# EAGLE schematic Smarttree_CMU_6 (EAGLE 7.7.0)

## Sheet 1 of 2
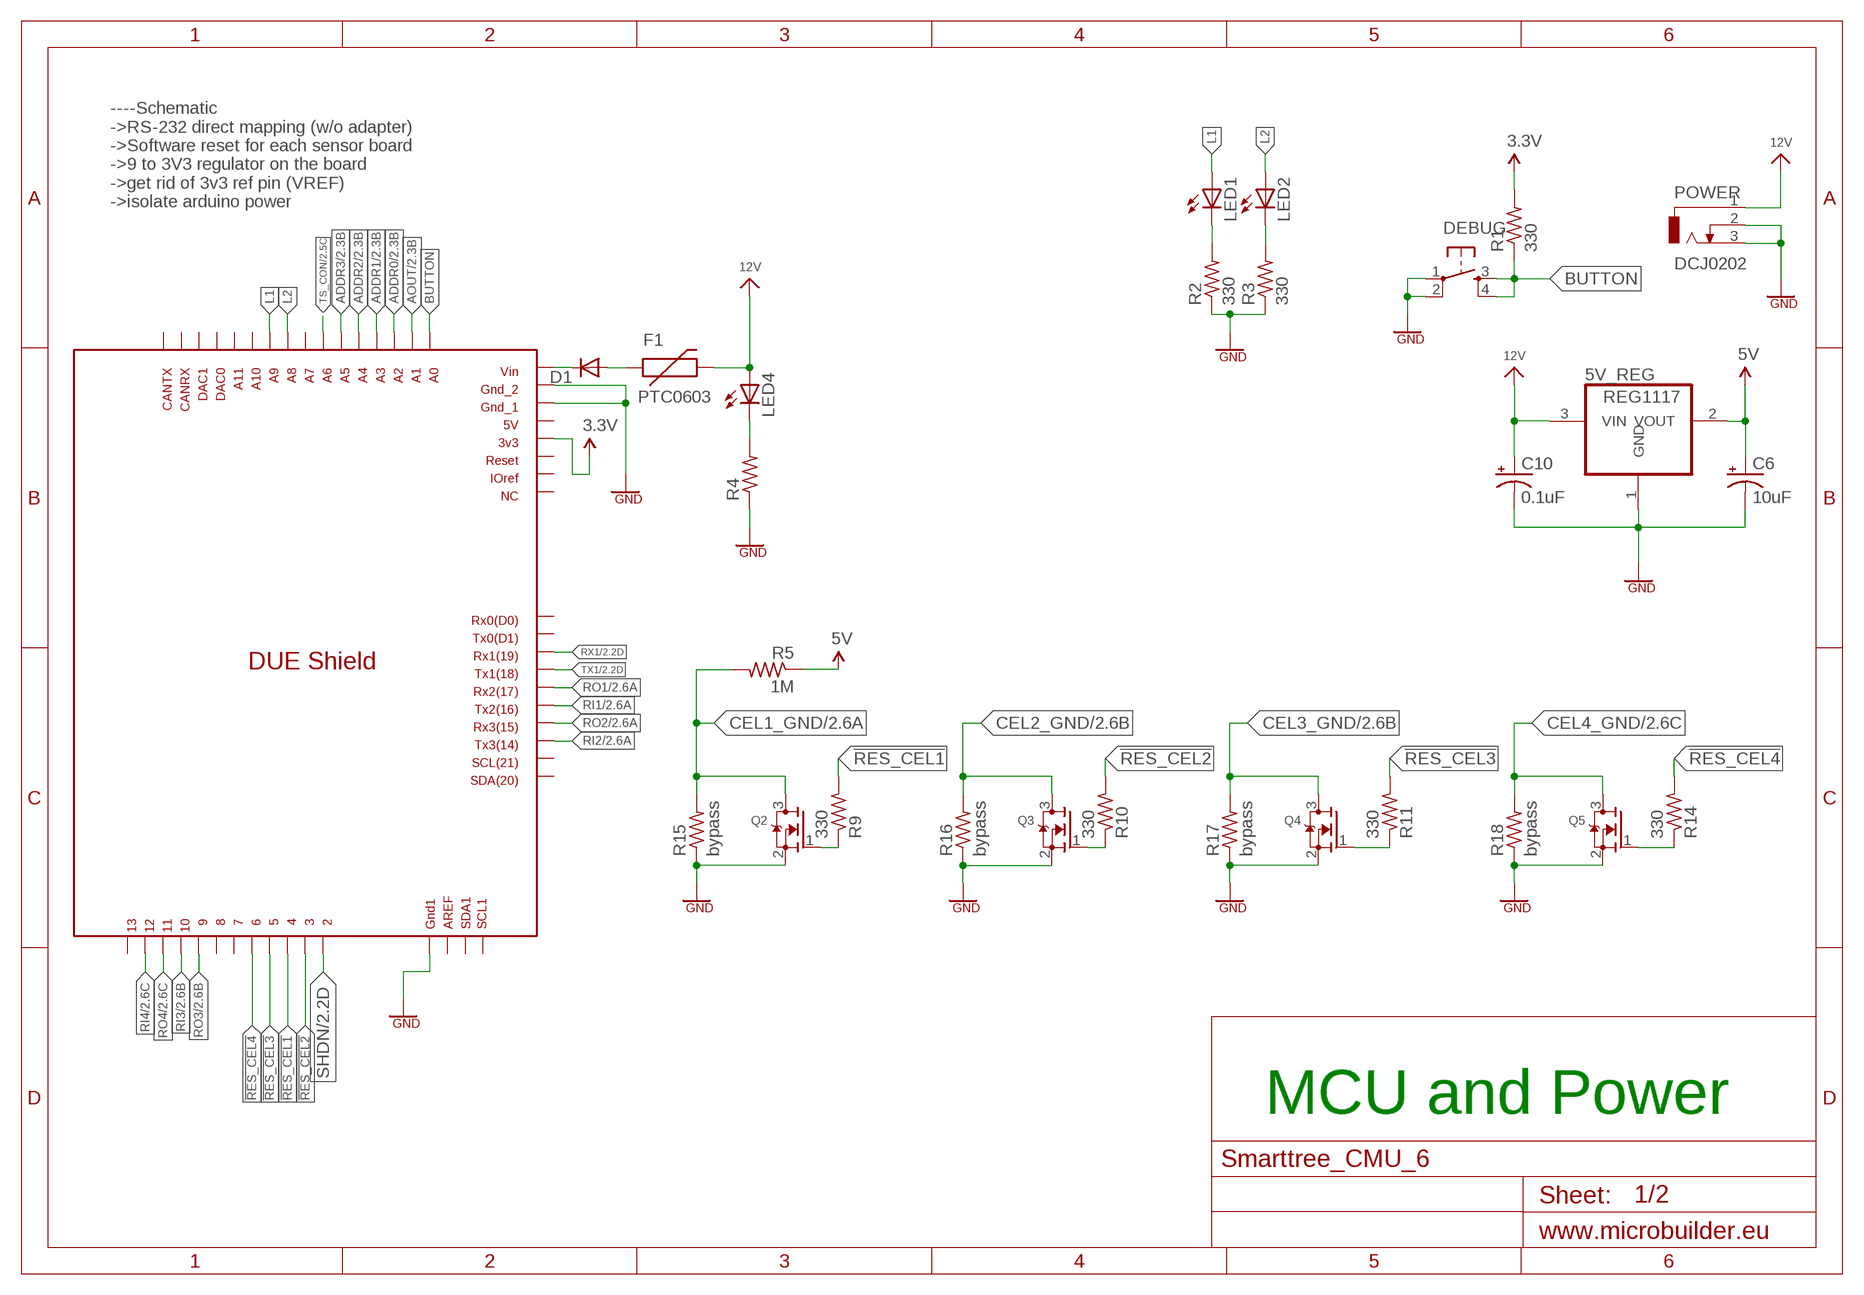
[diagram p0: schematic, sheet 1]

### Parts
5V_REG  REG1117  [SOT223]
C6  10uF  10UF-TANT  [EIA3216]
C10  0.1uF  10UF-TANT  [EIA3216]
D1  DIODE-SOD106-R  [SOD106-R]
DEBUG  TAC_SWITCHSMD  [TACTILE_SWITCH_SMD]
F1  PTC0603  [0603]
LED1  LED-YELLOW0603  [LED-0603]
LED2  LED-YELLOW0603  [LED-0603]
LED4  LED-YELLOW0603  [LED-0603]
POWER  DCJ0202  [DCJ0202]
Q2  MOSFET-NREFLOW  [SOT23]
Q3  MOSFET-NREFLOW  [SOT23]
Q4  MOSFET-NREFLOW  [SOT23]
Q5  MOSFET-NREFLOW  [SOT23]
R1  330  R-US_M0805  [M0805]
R2  330  R-US_M0805  [M0805]
R3  330  R-US_M0805  [M0805]
R4  R-US_M0805  [M0805]
R5  1M  R-US_R0805  [R0805]
R9  330  R-US_R0805  [R0805]
R10  330  R-US_R0805  [R0805]
R11  330  R-US_R0805  [R0805]
R14  330  R-US_R0805  [R0805]
R15  bypass  R-US_M0805  [M0805]
R16  bypass  R-US_M0805  [M0805]
R17  bypass  R-US_M0805  [M0805]
R18  bypass  R-US_M0805  [M0805]
U$1  DUE(OUTLINE)  [DUE(NORMAL)]

### Nets
3.3V: R1.2 U$1.3V3 ; also sheet 2
5V: 5V_REG.2(VOUT) C6.A(+) R5.1 ; also sheet 2
12V: 5V_REG.3(VIN) C10.A(+) F1.2 LED4.A POWER.1 ; also sheet 2
!RES_CEL1: R9.2 U$1.4
!RES_CEL2: R10.2 U$1.3
!RES_CEL3: R11.2 U$1.5
!RES_CEL4: R14.2 U$1.6
ADDR0: U$1.A2 ; also sheet 2
ADDR1: U$1.A3 ; also sheet 2
ADDR2: U$1.A4 ; also sheet 2
ADDR3: U$1.A5 ; also sheet 2
AOUT: U$1.A1 ; also sheet 2
BUTTON: DEBUG.3 DEBUG.4 R1.1 U$1.A0
CEL1_GND: Q2.3(D) R5.2 R15.2 ; also sheet 2
CEL2_GND: Q3.3(D) R16.2 ; also sheet 2
CEL3_GND: Q4.3(D) R17.2 ; also sheet 2
CEL4_GND: Q5.3(D) R18.2 ; also sheet 2
GND: 5V_REG.1(GND) C6.C(-) C10.C(-) DEBUG.1 DEBUG.2 POWER.2 POWER.3 Q2.2(S) Q3.2(S) Q4.2(S) Q5.2(S) R2.1 R3.1 R4.1 R15.1 R16.1 R17.1 R18.1 U$1.GND1 U$1.GND_1 U$1.GND_2 ; also sheet 2
L1: LED1.A U$1.A9
L2: LED2.A U$1.A8
N$3: Q3.1(G) R10.1
N$6: Q2.1(G) R9.1
N$7: Q4.1(G) R11.1
N$9: Q5.1(G) R14.1
N$13: D1.C U$1.VIN
N$57: LED1.C R2.2
N$58: LED2.C R3.2
N$59: LED4.C R4.2
N$69: D1.A F1.1
RI1: U$1.TX2 ; also sheet 2
RI2: U$1.TX3 ; also sheet 2
RI3: U$1.10 ; also sheet 2
RI4: U$1.12 ; also sheet 2
RO1: U$1.RX2 ; also sheet 2
RO2: U$1.RX3 ; also sheet 2
RO3: U$1.9 ; also sheet 2
RO4: U$1.11 ; also sheet 2
RX1: U$1.RX1 ; also sheet 2
SHDN: U$1.2 ; also sheet 2
TS_CON: U$1.A6 ; also sheet 2
TX1: U$1.TX1 ; also sheet 2
Unconnected: U$1.5V U$1.7 U$1.8 U$1.13 U$1.A7 U$1.A10 U$1.A11 U$1.AREF U$1.CANRX U$1.CANTX U$1.DAC0 U$1.DAC1 U$1.IOREF U$1.NC U$1.RESET U$1.RX0 U$1.SCL U$1.SCL1 U$1.SDA U$1.SDA1 U$1.TX0

### Notes on the sheet
- ----Schematic
  ->RS-232 direct mapping (w/o adapter)
  ->Software reset for each sensor board
  ->9 to 3V3 regulator on the board
  ->get rid of 3v3 ref pin (VREF)
  ->isolate arduino power
- MCU and Power

## Sheet 2 of 2
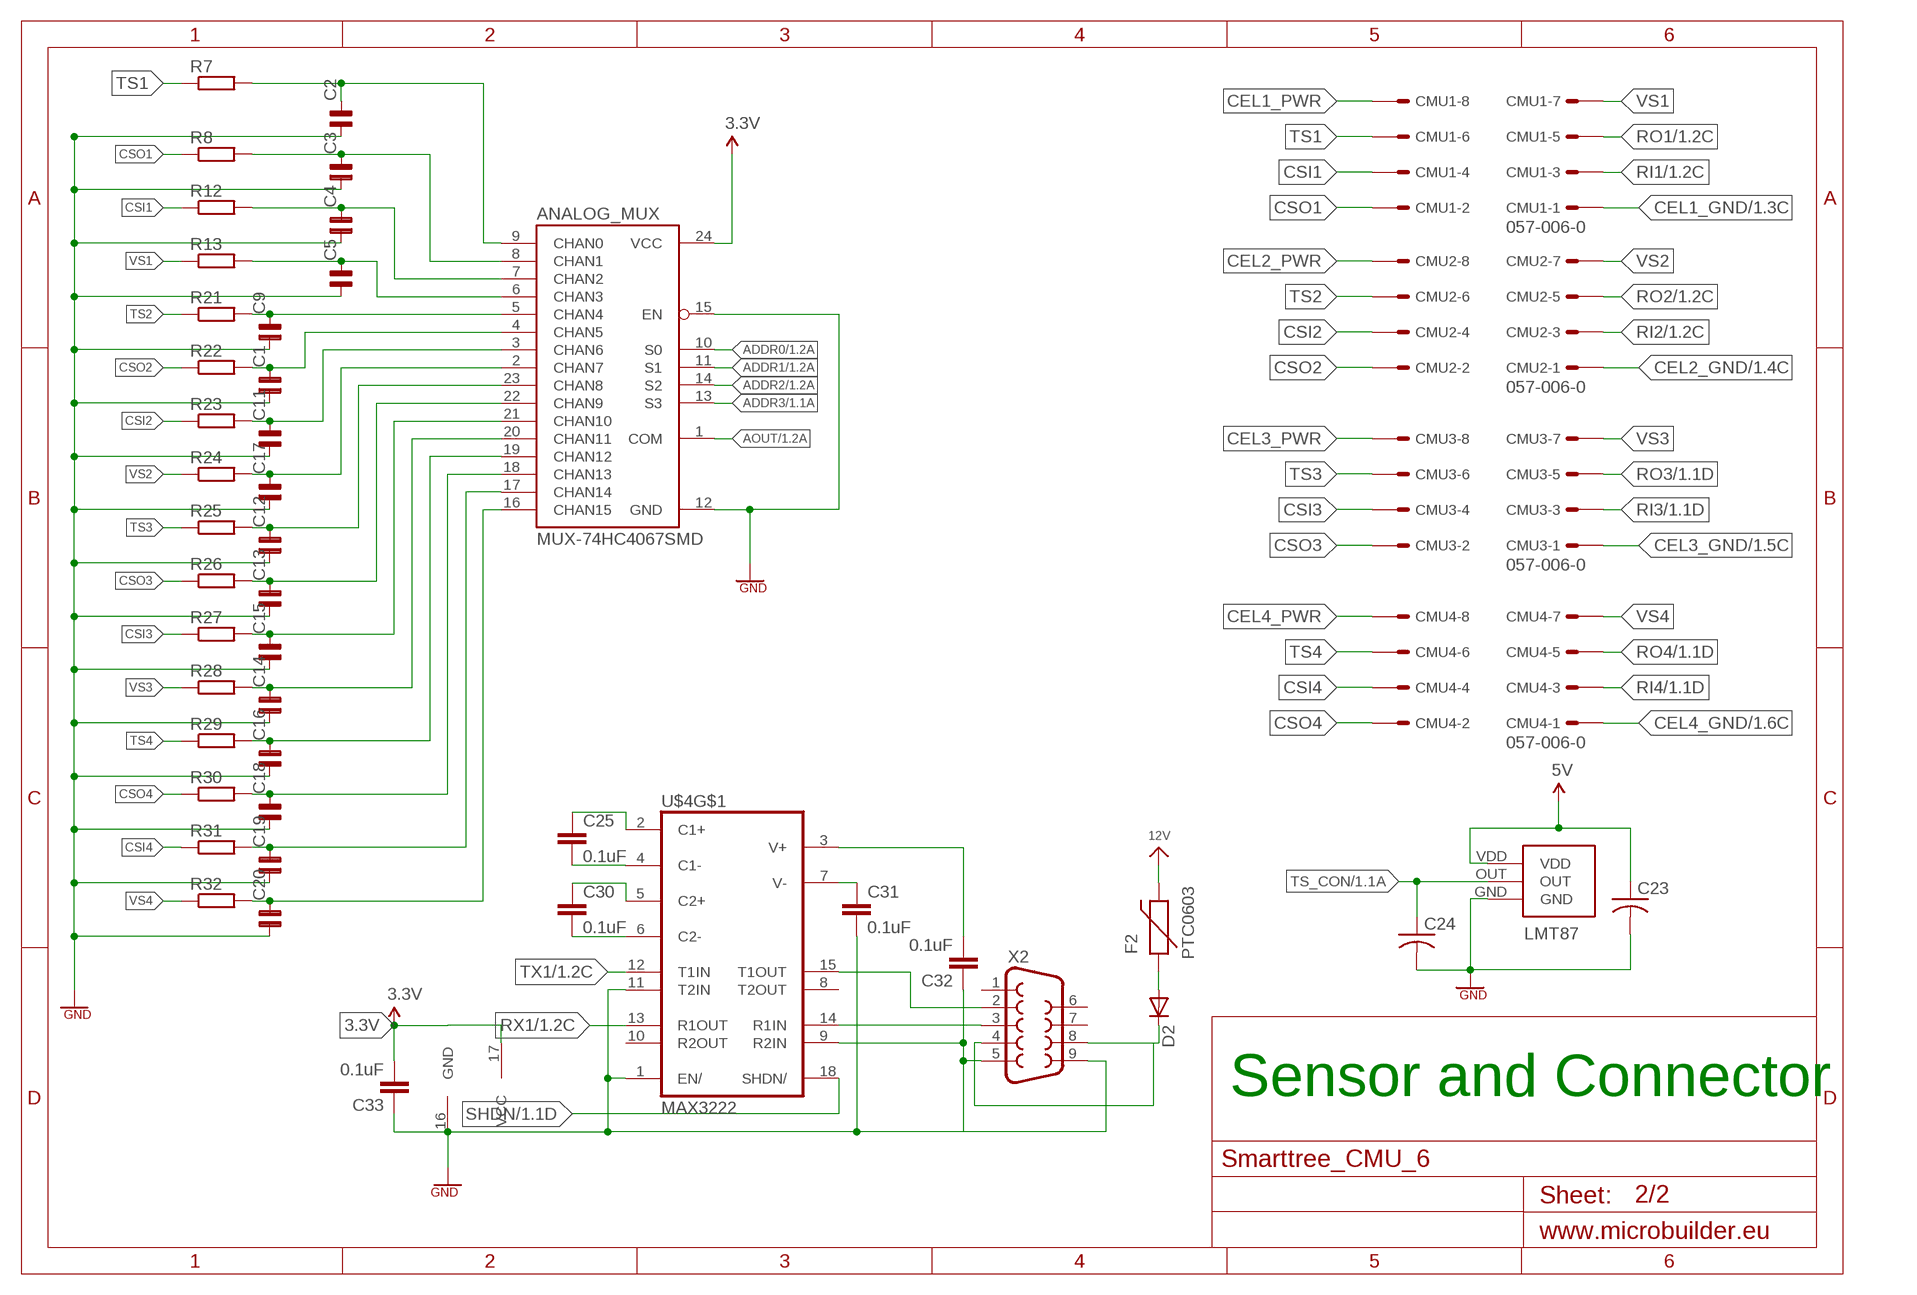
[diagram p1: schematic, sheet 2]

### Parts
ANALOG_MUX  MUX-74HC4067SMD  [SSOP24]
C1  C-NP-SMD-0805  [C-0805]
C2  C-NP-SMD-0805  [C-0805]
C3  C-NP-SMD-0805  [C-0805]
C4  C-NP-SMD-0805  [C-0805]
C5  C-NP-SMD-0805  [C-0805]
C9  C-NP-SMD-0805  [C-0805]
C11  C-NP-SMD-0805  [C-0805]
C12  C-NP-SMD-0805  [C-0805]
C13  C-NP-SMD-0805  [C-0805]
C14  C-NP-SMD-0805  [C-0805]
C15  C-NP-SMD-0805  [C-0805]
C16  C-NP-SMD-0805  [C-0805]
C17  C-NP-SMD-0805  [C-0805]
C18  C-NP-SMD-0805  [C-0805]
C19  C-NP-SMD-0805  [C-0805]
C20  C-NP-SMD-0805  [C-0805]
C23  C-USC0805  [C0805]
C24  C-USC0805  [C0805]
C25  0.1uF  CAP0603-CAP  [0603-CAP]
C30  0.1uF  CAP0603-CAP  [0603-CAP]
C31  0.1uF  CAP0603-CAP  [0603-CAP]
C32  0.1uF  CAP0603-CAP  [0603-CAP]
C33  0.1uF  CAP0603-CAP  [0603-CAP]
CMU1  057-006-0  [057-006-0]
CMU2  057-006-0  [057-006-0]
CMU3  057-006-0  [057-006-0]
CMU4  057-006-0  [057-006-0]
D2  DIODE-SOD106-R  [SOD106-R]
F2  PTC0603  [0603]
LMT87  LMT87_PAC  [LMT87_TO]
R7  R-EU_R0805W  [R0805W]
R8  R-EU_R0805W  [R0805W]
R12  R-EU_R0805W  [R0805W]
R13  R-EU_R0805W  [R0805W]
R21  R-EU_R0805W  [R0805W]
R22  R-EU_R0805W  [R0805W]
R23  R-EU_R0805W  [R0805W]
R24  R-EU_R0805W  [R0805W]
R25  R-EU_R0805W  [R0805W]
R26  R-EU_R0805W  [R0805W]
R27  R-EU_R0805W  [R0805W]
R28  R-EU_R0805W  [R0805W]
R29  R-EU_R0805W  [R0805W]
R30  R-EU_R0805W  [R0805W]
R31  R-EU_R0805W  [R0805W]
R32  R-EU_R0805W  [R0805W]
U$4  MAX3222  [SO18]
X2  DB9MALE  [DB9_MALE]

### Nets
3.3V: ANALOG_MUX.24(VCC) C33.2 U$4.17(VCC) ; also sheet 1
5V: C23.1 LMT87.VDD ; also sheet 1
12V: F2.2 ; also sheet 1
ADDR0: ANALOG_MUX.10(S0) ; also sheet 1
ADDR1: ANALOG_MUX.11(S1) ; also sheet 1
ADDR2: ANALOG_MUX.14(S2) ; also sheet 1
ADDR3: ANALOG_MUX.13(S3) ; also sheet 1
AOUT: ANALOG_MUX.1(COM) ; also sheet 1
CEL1_GND: CMU1.1 ; also sheet 1
CEL1_PWR: CMU1.7
CEL2_GND: CMU2.1 ; also sheet 1
CEL2_PWR: CMU2.7
CEL3_GND: CMU3.1 ; also sheet 1
CEL3_PWR: CMU3.7
CEL4_GND: CMU4.1 ; also sheet 1
CEL4_PWR: CMU4.7
CSI1: CMU1.4 R12.1
CSI2: CMU2.4 R23.1
CSI3: CMU3.4 R27.1
CSI4: CMU4.4 R31.1
CSO1: CMU1.2 R8.1
CSO2: CMU2.2 R22.1
CSO3: CMU3.2 R26.1
CSO4: CMU4.2 R30.1
GND: ANALOG_MUX.12(GND) ANALOG_MUX.15(EN) C1.1 C2.1 C3.1 C4.1 C5.1 C9.1 C11.1 C12.1 C13.1 C14.1 C15.1 C16.1 C17.1 C18.1 C19.1 C20.1 C23.2 C24.2 C31.2 C32.1 C33.1 LMT87.GND U$4.1(EN/) U$4.9(R2IN) U$4.11(T2IN) U$4.16(GND) X2.5 X2.9 ; also sheet 1
N$2: C31.1 U$4.7(V-)
N$4: D2.C X2.4 X2.8
N$5: D2.A F2.1
N$8: C25.1 U$4.2(C1+)
N$14: C25.2 U$4.4(C1-)
N$15: C30.1 U$4.5(C2+)
N$16: C30.2 U$4.6(C2-)
N$17: ANALOG_MUX.6(CHAN3) C5.2 R13.2
N$18: C32.2 U$4.3(V+)
N$19: ANALOG_MUX.8(CHAN1) C3.2 R8.2
N$20: ANALOG_MUX.7(CHAN2) C4.2 R12.2
N$24: ANALOG_MUX.5(CHAN4) C9.2 R21.2
N$26: ANALOG_MUX.4(CHAN5) C1.2 R22.2
N$28: ANALOG_MUX.3(CHAN6) C11.2 R23.2
N$30: ANALOG_MUX.2(CHAN7) C17.2 R24.2
N$32: ANALOG_MUX.23(CHAN8) C12.2 R25.2
N$34: ANALOG_MUX.22(CHAN9) C13.2 R26.2
N$36: ANALOG_MUX.21(CHAN10) C15.2 R27.2
N$38: ANALOG_MUX.20(CHAN11) C14.2 R28.2
N$39: ANALOG_MUX.19(CHAN12) C16.2 R29.2
N$42: ANALOG_MUX.18(CHAN13) C18.2 R30.2
N$43: ANALOG_MUX.17(CHAN14) C19.2 R31.2
N$46: ANALOG_MUX.16(CHAN15) C20.2 R32.2
RI1: CMU1.3 ; also sheet 1
RI2: CMU2.3 ; also sheet 1
RI3: CMU3.3 ; also sheet 1
RI4: CMU4.3 ; also sheet 1
RO1: CMU1.5 ; also sheet 1
RO2: CMU2.5 ; also sheet 1
RO3: CMU3.5 ; also sheet 1
RO4: CMU4.5 ; also sheet 1
RX: U$4.14(R1IN) X2.3
RX1: U$4.13(R1OUT) ; also sheet 1
SHDN: U$4.18(SHDN/) ; also sheet 1
TS1: CMU1.6 R7.1
TS1OUT: ANALOG_MUX.9(CHAN0) C2.2 R7.2
TS2: CMU2.6 R21.1
TS3: CMU3.6 R25.1
TS4: CMU4.6 R29.1
TS_CON: C24.1 LMT87.OUT ; also sheet 1
TX: U$4.15(T1OUT) X2.2
TX1: U$4.12(T1IN) ; also sheet 1
VS1: CMU1.8 R13.1
VS2: CMU2.8 R24.1
VS3: CMU3.8 R28.1
VS4: CMU4.8 R32.1
Unconnected: U$4.8(T2OUT) U$4.10(R2OUT) X2.1 X2.6 X2.7

### Notes on the sheet
- Sensor and Connector

## Library data of the parts
5V_REG = burr-brown:REG1117: 800mA and 1A Low Dropout (LDO) Positive Regulator 1.8V, 2.5V, 2.85V, 3.3V, 5V, and Adj; MPN: REG1117; OC_FARNELL: 1097566; OC_NEWARK: 14P6981
ANALOG_MUX = SparkFun-AnalogIC:MUX-74HC4067: 16-channel analog MUX; OC_NEWARK: unknown
C1-C5 C9 C11-C20 = cap-pan40:C-NP: NON-POLARIZED FILM/CHIP; OC_NEWARK: unknown
C6 = SparkFun-Retired:10UF-TANT: 10uF Tantalum SMT CAP-00811- 16V 10% (EIA-3216); OC_NEWARK: unknown; PROD_ID: CAP-00811
C10 = SparkFun-Retired:10UF-TANT: 10uF Tantalum SMT CAP-00811- 16V 10% (EIA-3216); OC_NEWARK: unknown; PROD_ID: CAP-00811; VALUE: 10uF
C23 C24 = adafruit:C-US: CAPACITOR, American symbol
C25 C30-C33 = SparkFun:CAP: Capacitor Standard 0603 ceramic capacitor, and 0.1" leaded capacitor.
CMU1-CMU4 = con-panduit:057-006-: CONNECTOR 6-pin series 057 contact pc board low profile headers
D1 D2 = diode:DIODE-: DIODE; OC_NEWARK: unknown
DEBUG = SparkFun-Electromechanical:TAC_SWITCH: Momentary Switch Button commonly used for reset or general input. Spark Fun Electronics SKU : COM-00097 SMT- SWCH-08247; PROD_ID: SWCH-08247
F1 F2 = SparkFun:PTC: Resettable Fuse PTC Resettable Fuse. Spark Fun Electronics SKU : COM-08357
LED1 LED2 LED4 = SparkFun-LED:LED-YELLOW: Yellow SMD LEDs LilyPad 1206- DIO-09909 0603- DIO-09003; PROD_ID: DIO-09003
LMT87 = nick:LMT87_PAC
POWER = con-jack:DCJ0202: DC POWER JACK Source: DCJ0202.pdf; OC_FARNELL: unknown; OC_NEWARK: unknown
Q2-Q5 = adafruit:MOSFET-N: N-Channel Mosfet 2N7002E - 60V 260mA SOT23 [Digikey: 2N7002ET1GOSTR-ND] - REEL BSH103 - 30V 850mA SOT23 [Digikey: 568-5013-1-ND]
R1-R4 R15-R18 = adafruit:R-US_: RESISTOR, American symbol; OC_NEWARK: unknown
R5 R9-R11 R14 = adafruit:R-US_: RESISTOR, American symbol
R7 R8 R12 R13 R21-R32 = resistor:R-EU_: RESISTOR, European symbol; OC_NEWARK: unknown
U$1 = DUElib130425:DUE(OUTLINE)
U$4 = Francis-Project:MAX3222
X2 = SparkFun-Connectors:DB9: DB9 Connector Standard DB9 (D-Sub 9) serial connector. Can be used for CAN bus as well as RS485 and RS232. Footprint production proven. Spark Fun Electronics SKU : PRT-00429; PROD_ID: CONN-09904